# Altium schematic sheet Sheet1.SchDoc
size A; SheetNumber: 1; SheetTotal: 1
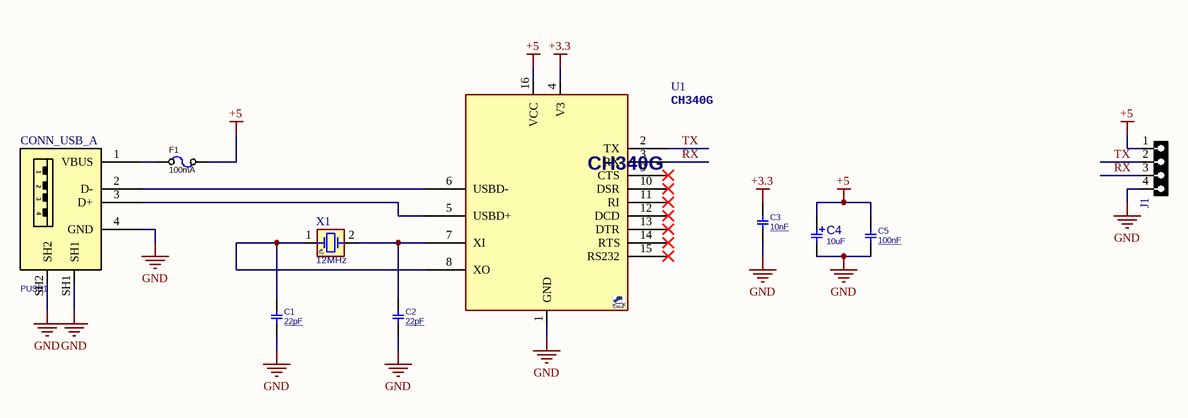
[diagram p0: Sheet1.SchDoc]

## Parts
C1  22pF  [C1206]
C2  22pF  [C1206]
C3  10nF  [C1206]
C4  10uF  [C_EL_5]
C5  100nF  [C1206]
F1  100mA  [F1206]
J1  HDRF4  [HDR_F_1X4]  (value not drawn)
PUSB1  CONN_USB_A  [USB_A_PLG_RA]
U1  CH340G  [SO_16]
X1  12MHz  [XTL_2_11X5]

## Nets
+3.3: C3.2 U1.4(V3)
+5: C4.1 C5.2 F1.2 J1.1 U1.16(VCC)
GND: C1.1 C2.1 C3.1 C4.2 C5.1 J1.4 PUSB1.4(GND) PUSB1.SH1 PUSB1.SH2 U1.1(GND)
RX: J1.3 U1.3(RX)
TX: J1.2 U1.2(TX)
NetC1_2: C1.2 U1.8(XO) X1.1(OSC1)
NetC2_2: C2.2 U1.7(XI) X1.2(OSC2)
NetF1_1: F1.1 PUSB1.1(VBUS)
NetPUSB1_2: PUSB1.2(D-) U1.6(USBD-)
NetPUSB1_3: PUSB1.3(D+) U1.5(USBD+)

Not connected (* = marked no-connect by the designer): U1 9(CTS)* 10(DSR)* 11(RI)* 12(DCD)* 13(DTR)* 14(RTS)* 15(RS232)*

## Library data of the parts
C1-C3 C5 = CAP_SMD_FILM: CAP, FILM, 680nF, 16V, Acryl, 20%, 1206; PARAM: Acrylic, MetallizedStacked, 20%, -40~85oC; MANF: Murata; PRICE: 100= 40$; DESC: -; MANF_P#: -; PARAM2: 16V; ASSEMBLY: ASSEMBLY
  C1 C2: VALUE: 22pF
  C3: VALUE: 10nF
  C5: VALUE: 100nF
C4 = CAP_SMD_EL: CAP, THD, ELEC,; MANF_P#: MANF_PART#; PARAM2: -V; DESC: DESCRIPTION; DIST#: MOUSER; PARAM: 20%; PRICE: 10= -$; MANF: MANF; ASSEMBLY: ASSEMBLY; VALUE: 10uF
F1 = FUSE_3A_1206_SLOW: Fuse, 3A, 32VDC, 1206, SMD, Slow Blow; PARAM: 3A; 32VDC; Slow Blow; MANF: Bourns; MANF_P#: SF-1206SP300-2; PARAM2: 0.027Ohm; PRICE: 0.9$; VALUE: 100mA
J1 = HDR_F_1X4: CONN, HEADER, Female, pitch: 2.54mm, 4POS; VALUE: HDRF4
PUSB1 = CONN_USB_A_PLUG: CONN, USB, A, PLUG, THD; VALUE: CONN_USB_A
U1 = CH340G_SOP16: USB-UART; MANF_P#: CH340G; VALUE: CH340G
X1 = XTL_2_HC49_8MHz_SMD: Crystal MOST POPULAR ABL HC49 PACKAGE; MANF: ABRACON; MANF_P#: ABLS-8.000MHZ-B4-T; PARAM: 8MHz, 18pF, 30PPM, -20~70oC; PRICE: 0.3$; VALUE: 12MHz